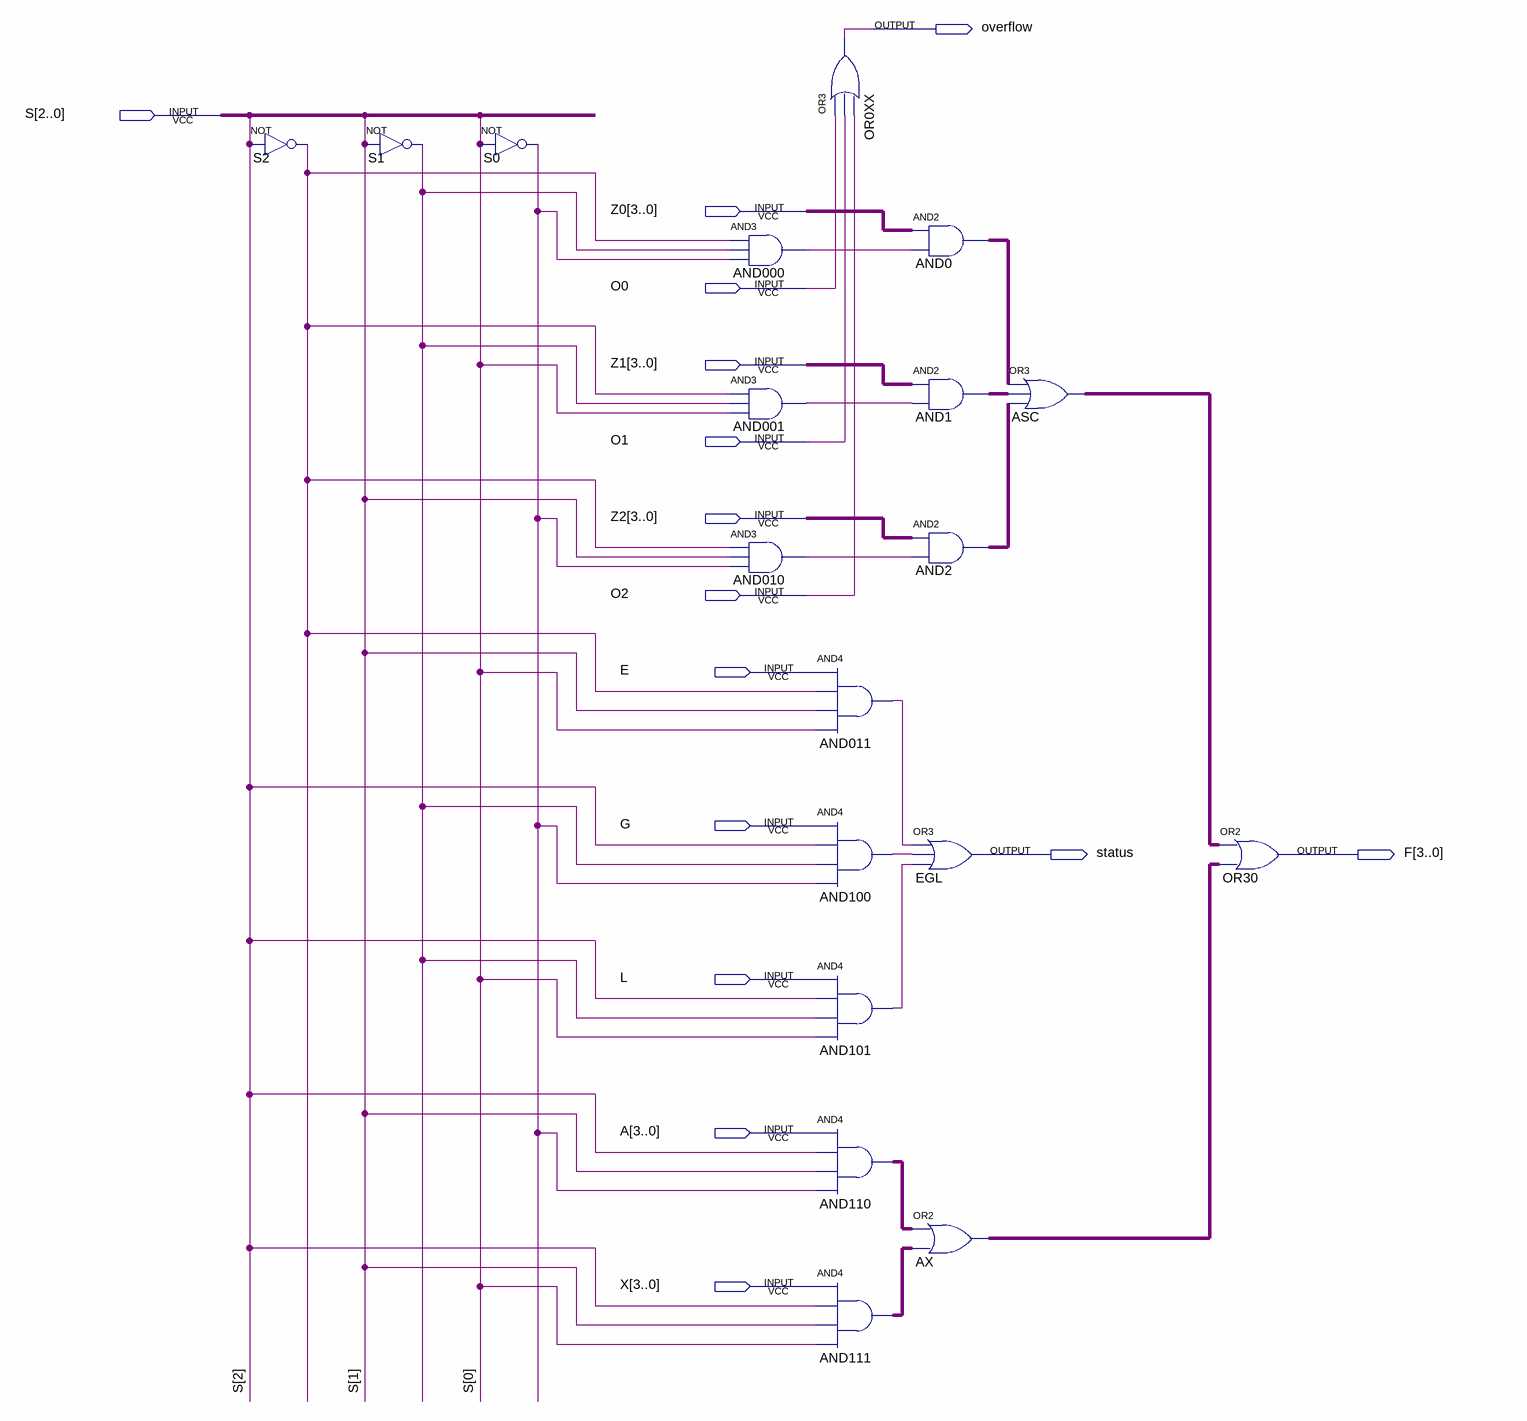
[diagram p0: schematic sheet]
// Quartus schematic DEMUX.bdf as structural Verilog: 19 symbols, 15 pins
module DEMUX (
  input  [2:0] S,
  input  [3:0] Z0,
  input  O0,
  input  [3:0] Z1,
  input  O1,
  input  [3:0] Z2,
  input  O2,
  input  E,
  input  G,
  input  L,
  input  [3:0] A,
  input  [3:0] X,
  output overflow,
  output status,
  output [3:0] F
);

  wire AND000_out, AND001_out, AND010_out, AND011_out, AND100_out, AND101_out, S0_out, S1_out, S2_out;
  wire [3:0] AND0_out, AND1_out, AND2_out, AND110_out, AND111_out, ASC_out, AX_out;

  not S2 (S2_out, S[2]);
  not S1 (S1_out, S[1]);
  not S0 (S0_out, S[0]);
  and AND000 (AND000_out, S2_out, S1_out, S0_out);
  and AND001 (AND001_out, S2_out, S1_out, S[0]);
  and AND010 (AND010_out, S2_out, S[1], S0_out);
  or OR0XX (overflow, O0, O1, O2);
  and AND011 (AND011_out, E, S2_out, S[1], S[0]);
  and AND100 (AND100_out, G, S[2], S1_out, S0_out);
  and AND101 (AND101_out, L, S[2], S1_out, S[0]);
  assign AND110_out = A & {4{S[2]}} & {4{S[1]}} & {4{S0_out}};  // AND4 AND110, 4 bits wide
  assign AND111_out = X & {4{S[2]}} & {4{S[1]}} & {4{S[0]}};  // AND4 AND111, 4 bits wide
  assign AND0_out = Z0 & {4{AND000_out}};  // AND2 AND0, 4 bits wide
  assign AND1_out = Z1 & {4{AND001_out}};  // AND2 AND1, 4 bits wide
  assign AND2_out = Z2 & {4{AND010_out}};  // AND2 AND2, 4 bits wide
  or EGL (status, AND011_out, AND100_out, AND101_out);
  assign AX_out = AND110_out | AND111_out;  // OR2 AX, 4 bits wide
  assign ASC_out = AND0_out | AND1_out | AND2_out;  // OR3 ASC, 4 bits wide
  assign F = ASC_out | AX_out;  // OR2 OR30, 4 bits wide
endmodule
